# EAGLE board all_in_one_v2 (EAGLE 4.16), part 1 of 3
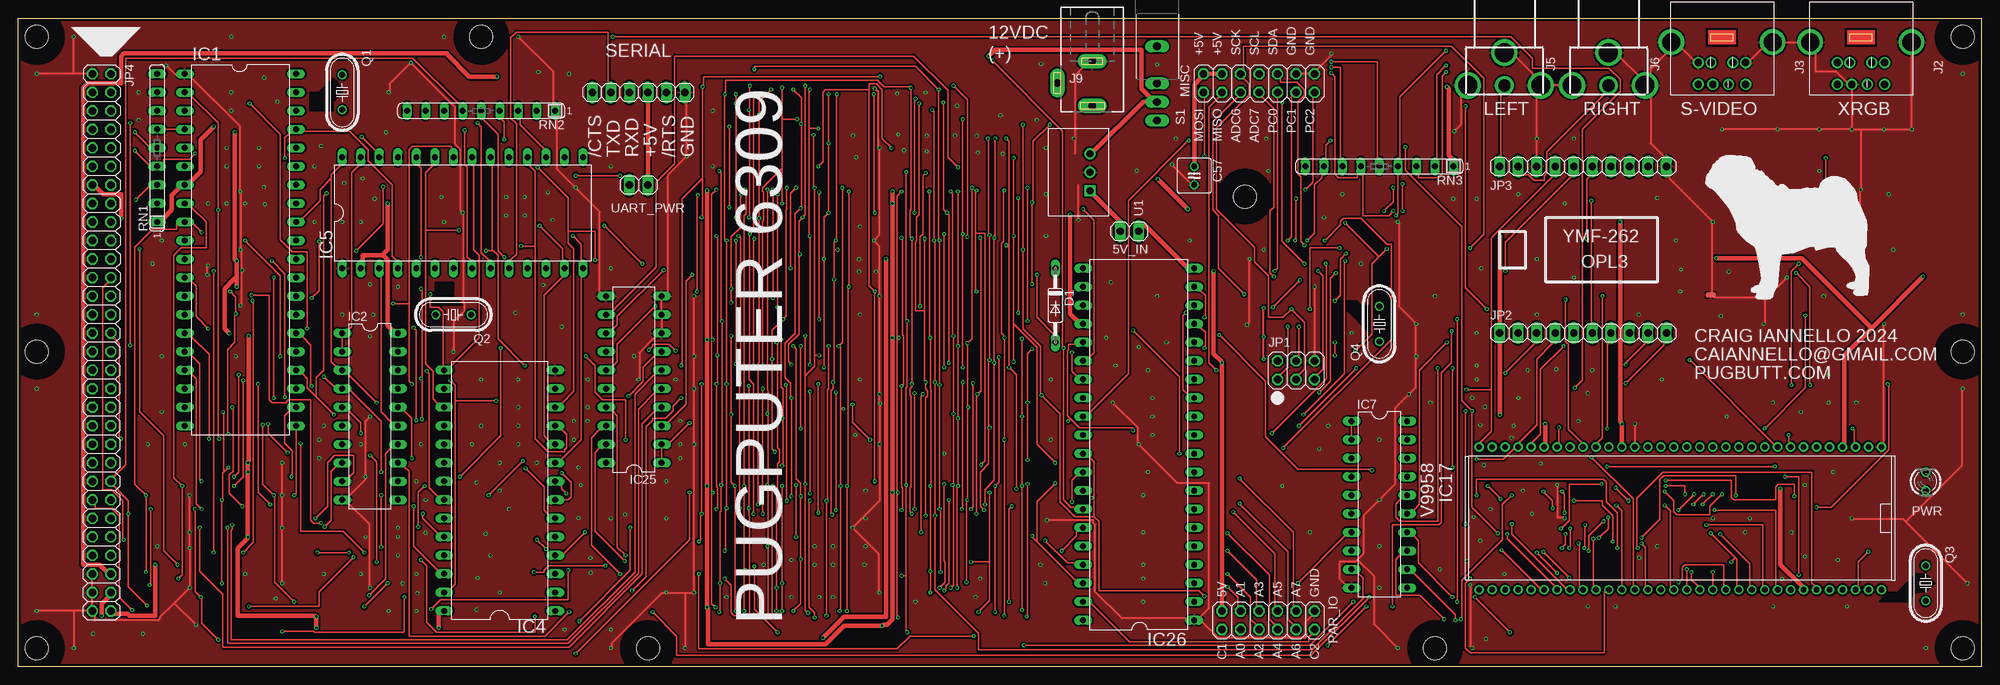
[diagram p2: board, top side]
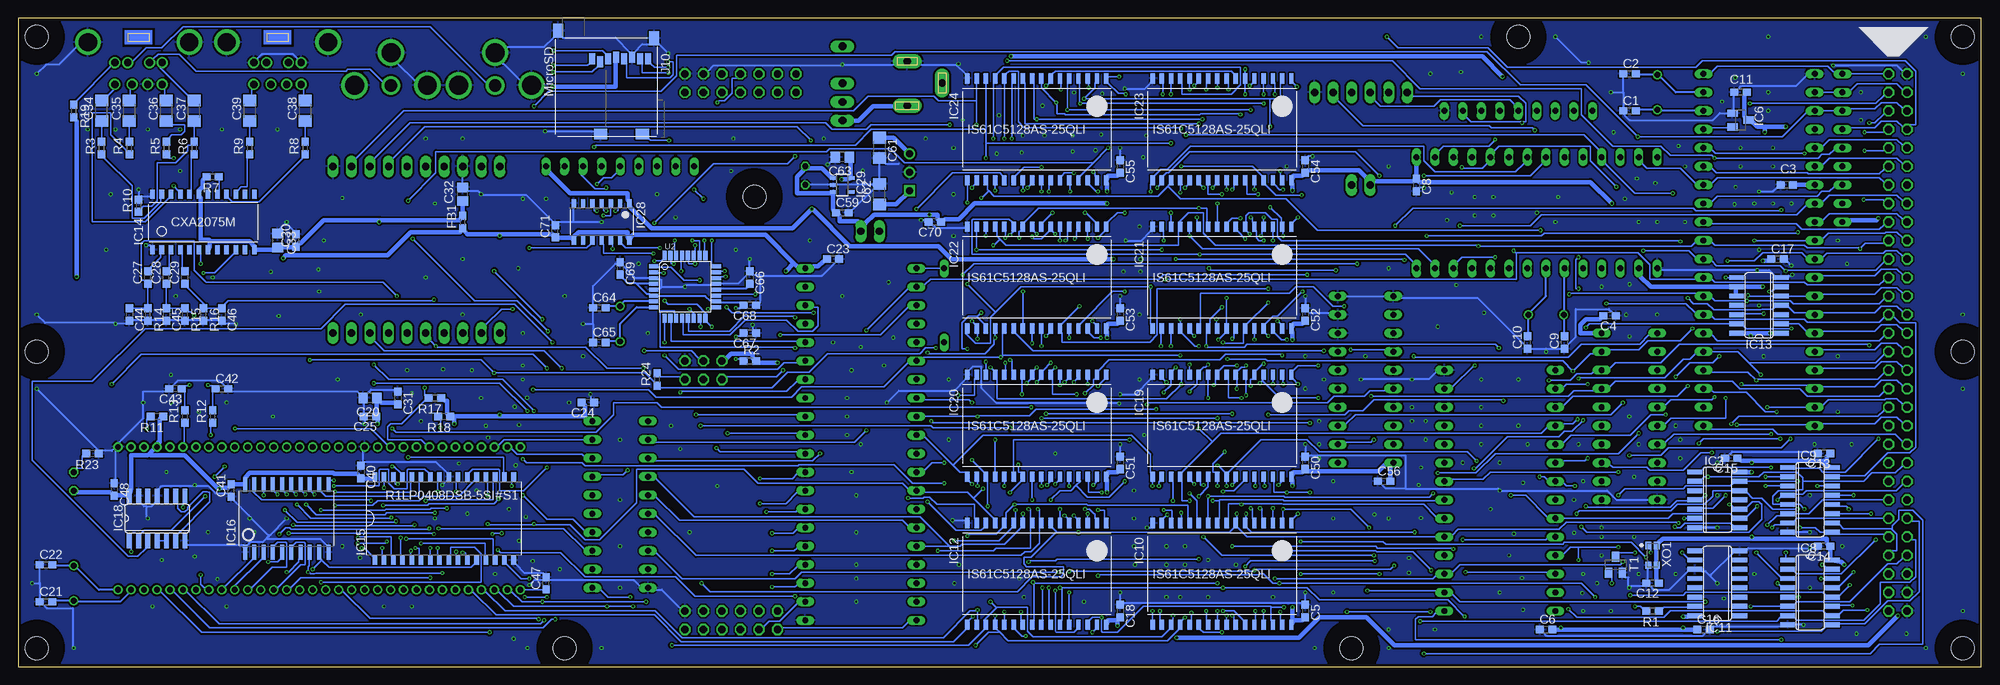
[diagram p3: board, bottom side, seen from below]

Size 269.24 x 88.9 mm. Coordinates in mm from the lower left corner, seen from the top.
Outline: 0,88.9 269.24,88.9 269.24,0 0,0 0,88.9
Copper layers (1*16): Top 0.0356mm / dielectric 1.6mm / Bottom 0.0356mm
Design rules "oshpark-2layer": minimum track width 6mil, minimum drill 10mil, track to track 6mil, track to pad 6mil, pad to pad 6mil, via to via 6mil, smd to smd 6mil, copper to edge 15mil, drill to drill 6mil, minimum pad ring 5mil, minimum via ring 5mil, stop-mask expansion 2.5mil, vias tented up to drill 0mil, thermal gap 10mil
Net classes: 0 default: width 0.203 mm, drill 0.203 mm, clearance 0.254 mm; 1 supply: width 0.61 mm, drill 0.203 mm, clearance 0.305 mm; 2 lowpwr: width 0.254 mm, drill 0.203 mm, clearance 0.254 mm
Holes 3.17 mm at 266.7,86.36 266.7,2.54 2.54,2.54 2.54,86.36 2.54,43.18 266.7,43.18 86.36,2.54 194.31,2.54 168.28,64.45 63.5,86.36
tRestrict: area -1.3,82.5 to 6.3,90.2; area -1.3,39.4 to 6.3,47; area -1.3,-1.3 to 6.3,6.3; area 82.5,-1.3 to 90.2,6.3; area 190.5,-1.3 to 198.1,6.3; area 262.9,-1.3 to 270.5,6.3; area 262.9,39.4 to 270.5,47; area 262.9,82.5 to 270.5,90.2; area 164.5,60.6 to 172.1,68.3; area 59.7,82.5 to 67.3,90.2; area 255.3,8.9 to 262.9,12.7; area 182.2,45.7 to 185.4,50.2; 2 more areas
bRestrict: area -1.3,82.5 to 6.4,90.2; area -1.3,39.3 to 6.4,47; area -1.3,-1.3 to 6.4,6.4; area 59.6,82.5 to 67.4,90.2; area 82.5,-1.3 to 90.2,6.4; area 164.4,60.6 to 172.1,68.3; area 262.8,39.3 to 270.6,47; area 262.8,82.5 to 270.6,90.2; area 190.4,-1.3 to 198.2,6.4; area 262.8,-1.3 to 270.6,6.4
vRestrict: area 180.3,72.4 to 195.6,88.9

## Footprints (pad centres in the part's own frame; a part is rotated, then mirrored left to right if it is on the bottom)
1X02 = drill 1.016 long: 1 -1.27,0; 2 1.27,0
C0603 = smd 1.1 x 1: 1 -0.85,0; 2 0.85,0
C0805 = smd 1.3 x 1.5: 1 -0.95,0; 2 0.95,0
C1206 = smd 1.6 x 1.8: 1 -1.4,0; 2 1.4,0
C025-050X050 = drill 0.813 octagon: 1 -1.27,0; 2 1.27,0
DO35-10 = drill 0.813 long: A 5.08,0; C -5.08,0
R0603 = smd 1.1 x 1: 1 -0.85,0; 2 0.85,0
DIL40 = drill 0.813 long: 1 -24.13,-7.62; 2 -21.59,-7.62; 3 -19.05,-7.62; 4 -16.51,-7.62; 5 -13.97,-7.62; 6 -11.43,-7.62; 7 -8.89,-7.62; 8 -6.35,-7.62; 9 -3.81,-7.62; 10 -1.27,-7.62; 11 1.27,-7.62; 12 3.81,-7.62; 13 6.35,-7.62; 14 8.89,-7.62; 15 11.43,-7.62; 16 13.97,-7.62; 17 16.51,-7.62; 18 19.05,-7.62; 19 21.59,-7.62; 20 24.13,-7.62; 21 24.13,7.62; 22 21.59,7.62; 23 19.05,7.62; 24 16.51,7.62; 25 13.97,7.62; 26 11.43,7.62; 27 8.89,7.62; 28 6.35,7.62; 29 3.81,7.62; 30 1.27,7.62; 31 -1.27,7.62; 32 -3.81,7.62; 33 -6.35,7.62; 34 -8.89,7.62; 35 -11.43,7.62; 36 -13.97,7.62; 37 -16.51,7.62; 38 -19.05,7.62; 39 -21.59,7.62; 40 -24.13,7.62
DIL20 = drill 0.813 long: 1 -11.43,-3.81; 2 -8.89,-3.81; 3 -6.35,-3.81; 4 -3.81,-3.81; 5 -1.27,-3.81; 6 1.27,-3.81; 7 3.81,-3.81; 8 6.35,-3.81; 9 8.89,-3.81; 10 11.43,-3.81; 11 11.43,3.81; 12 8.89,3.81; 13 6.35,3.81; 14 3.81,3.81; 15 1.27,3.81; 16 -1.27,3.81; 17 -3.81,3.81; 18 -6.35,3.81; 19 -8.89,3.81; 20 -11.43,3.81
SO14 = smd 0.66 x 2.032: 1 -3.81,-3.073; 2 -2.54,-3.073; 3 -1.27,-3.073; 4 0,-3.073; 5 1.27,-3.073; 6 2.54,-3.073; 7 3.81,-3.073; 8 3.81,3.073; 9 2.54,3.073; 10 1.27,3.073; 11 0,3.073; 12 -1.27,3.073; 13 -2.54,3.073; 14 -3.81,3.073
DIL28-6 = drill 0.813 long: 1 -16.51,-7.62; 2 -13.97,-7.62; 3 -11.43,-7.62; 4 -8.89,-7.62; 5 -6.35,-7.62; 6 -3.81,-7.62; 7 -1.27,-7.62; 8 1.27,-7.62; 9 3.81,-7.62; 10 6.35,-7.62; 11 8.89,-7.62; 12 11.43,-7.62; 13 13.97,-7.62; 14 16.51,-7.62; 15 16.51,7.62; 16 13.97,7.62; 17 11.43,7.62; 18 8.89,7.62; 19 6.35,7.62; 20 3.81,7.62; 21 1.27,7.62; 22 -1.27,7.62; 23 -3.81,7.62; 24 -6.35,7.62; 25 -8.89,7.62; 26 -11.43,7.62; 27 -13.97,7.62; 28 -16.51,7.62
SOT23 = smd 1 x 1.4: 1 -0.95,-1.1; 2 0.95,-1.1; 3 0,1.1
SO16 = smd 0.66 x 2.032: 1 -4.445,-3.073; 2 -3.175,-3.073; 3 -1.905,-3.073; 4 -0.635,-3.073; 5 0.635,-3.073; 6 1.905,-3.073; 7 3.175,-3.073; 8 4.445,-3.073; 9 4.445,3.073; 10 3.175,3.073; 11 1.905,3.073; 12 0.635,3.073; 13 -0.635,3.073; 14 -1.905,3.073; 15 -3.175,3.073; 16 -4.445,3.073
SOIC32_11.3MM_WID = smd 1.4 x 0.6: 1 -6.985,9.525; 2 -6.985,8.255; 3 -6.985,6.985; 4 -6.985,5.715; 5 -6.985,4.445; 6 -6.985,3.175; 7 -6.985,1.905; 8 -6.985,0.635; 9 -6.985,-0.635; 10 -6.985,-1.905; 11 -6.985,-3.175; 12 -6.985,-4.445; 13 -6.985,-5.715; 14 -6.985,-6.985; 15 -6.985,-8.255; 16 -6.985,-9.525; 17 6.985,-9.525; 18 6.985,-8.255; 19 6.985,-6.985; 20 6.985,-5.715; 21 6.985,-4.445; 22 6.985,-3.175; 23 6.985,-1.905; 24 6.985,-0.635; 25 6.985,0.635; 26 6.985,1.905; 27 6.985,3.175; 28 6.985,4.445; 29 6.985,5.715; 30 6.985,6.985; 31 6.985,8.255; 32 6.985,9.525
CXA2075M = smd 1.27 x 0.635: 1 -3.81,6.985; 2 -3.81,5.715; 3 -3.81,4.445; 4 -3.81,3.175; 5 -3.81,1.905; 6 -3.81,0.635; 7 -3.81,-0.635; 8 -3.81,-1.905; 9 -3.81,-3.175; 10 -3.81,-4.445; 11 -3.81,-5.715; 12 -3.81,-6.985; 13 3.81,-6.985; 14 3.81,-5.715; 15 3.81,-4.445; 16 3.81,-3.175; 17 3.81,-1.905; 18 3.81,-0.635; 19 3.81,0.635; 20 3.81,1.905; 21 3.81,3.175; 22 3.81,4.445; 23 3.81,5.715; 24 3.81,6.985
RENESAS_32-TSOP-II = smd 1.27 x 0.635: 1 -5.715,9.525; 2 -5.715,8.255; 3 -5.715,6.985; 4 -5.715,5.715; 5 -5.715,4.445; 6 -5.715,3.175; 7 -5.715,1.905; 8 -5.715,0.635; 9 -5.715,-0.635; 10 -5.715,-1.905; 11 -5.715,-3.175; 12 -5.715,-4.445; 13 -5.715,-5.715; 14 -5.715,-6.985; 15 -5.715,-8.255; 16 -5.715,-9.525; 17 5.715,-9.525; 18 5.715,-8.255; 19 5.715,-6.985; 20 5.715,-5.715; 21 5.715,-4.445; 22 5.715,-3.175; 23 5.715,-1.905; 24 5.715,-0.635; 25 5.715,0.635; 26 5.715,1.905; 27 5.715,3.175; 28 5.715,4.445; 29 5.715,5.715; 30 5.715,6.985; 31 5.715,8.255; 32 5.715,9.525
SOIC20 = smd 2 x 0.55: 1 -4.645,5.715; 2 -4.645,4.445; 3 -4.645,3.175; 4 -4.645,1.905; 5 -4.645,0.635; 6 -4.645,-0.635; 7 -4.645,-1.905; 8 -4.645,-3.175; 9 -4.645,-4.445; 10 -4.645,-5.715; 11 4.645,-5.715; 12 4.645,-4.445; 13 4.645,-3.175; 14 4.645,-1.905; 15 4.645,-0.635; 16 4.645,0.635; 17 4.645,1.905; 18 4.645,3.175; 19 4.645,4.445; 20 4.645,5.715
V9958 = drill 0.8 pad 1.27 round: 1 -27.59,-9.79; 2 -25.81,-9.79; 3 -24.03,-9.79; 4 -22.25,-9.79; 5 -20.47,-9.79; 6 -18.69,-9.79; 7 -16.91,-9.79; 8 -15.13,-9.79; 9 -13.35,-9.79; 10 -11.57,-9.79; 11 -9.79,-9.79; 12 -8.01,-9.79; 13 -6.23,-9.79; 14 -4.45,-9.79; 15 -2.67,-9.79; 16 -0.89,-9.79; 17 0.89,-9.79; 18 2.67,-9.79; 19 4.45,-9.79; 20 6.23,-9.79; 21 8.01,-9.79; 22 9.79,-9.79; 23 11.57,-9.79; 24 13.35,-9.79; 25 15.13,-9.79; 26 16.91,-9.79; 27 18.69,-9.79; 28 20.47,-9.79; 29 22.25,-9.79; 30 24.03,-9.79; 31 25.81,-9.79; 32 27.59,-9.79; 33 27.59,9.79; 34 25.81,9.79; 35 24.03,9.79; 36 22.25,9.79; 37 20.47,9.79; 38 18.69,9.79; 39 16.91,9.79; 40 15.13,9.79; 41 13.35,9.79; 42 11.57,9.79; 43 9.79,9.79; 44 8.01,9.79; 45 6.23,9.79; 46 4.45,9.79; 47 2.67,9.79; 48 0.89,9.79; 49 -0.89,9.79; 50 -2.67,9.79; 51 -4.45,9.79; 52 -6.23,9.79; 53 -8.01,9.79; 54 -9.79,9.79; 55 -11.57,9.79; 56 -13.35,9.79; 57 -15.13,9.79; 58 -16.91,9.79; 59 -18.69,9.79; 60 -20.47,9.79; 61 -22.25,9.79; 62 -24.03,9.79; 63 -25.81,9.79; 64 -27.59,9.79
SOIC14 = smd 1.2 x 0.6: 1 -2.54,3.81; 2 -2.54,2.54; 3 -2.54,1.27; 4 -2.54,0; 5 -2.54,-1.27; 6 -2.54,-2.54; 7 -2.54,-3.81; 8 2.54,-3.81; 9 2.54,-2.54; 10 2.54,-1.27; 11 2.54,0; 12 2.54,1.27; 13 2.54,2.54; 14 2.54,3.81
SOT23-5 = smd 0.5 x 1: 1 -0.95,-1.2; 2 0,-1.2; 3 0.95,-1.2; 4 0.95,1.2; 5 -0.95,1.2
MINI_DIN8 = drill 1 round: 1 1.5,8.3; 2 -1.5,8.3; 3 3.25,8.3; 4 1.25,11.3; 5 -3.25,8.3; 6 3.25,11.3; 7 -0.9,11.3; 8 -3.25,11.3 | drill 2.5 round: SG0 -6.95,5.5; SG1 6.95,5.5
RCA_JACK_CUI_RCJ-014_CP-1403-ND = drill 2.6 round: G0 -5,0; G1 0,4.5; G2 5,0 | drill 1.7 round: V 0,0
DCJ0202 = drill 1 pad 2 long: 1 0,3.1; 2 4.8,0; 3 0,-3
MICROSD_AMPHENOL_GTFP08432B1HR = smd 0.8 x 1.5: 1/DAT2 1.95,-10.3; 2/CD/DAT3 0.85,-9.9; 3/CMD -0.25,-10.3; 4/VDD -1.35,-10.5; 5/CLK -2.45,-10.3; 6/VSS -3.55,-10.5; 7/DAT0 -4.65,-10.3; 8/DAT1 -5.75,-10.3 | smd 1.8 x 1.4: CDET -4.95,0; GND0 0.75,0 | smd 1.4 x 1.9: GND1 -6.55,-13.15; GND2 6.6,-14.15
2X03 = drill 1.016 octagon: 1 -2.54,-1.27; 2 -2.54,1.27; 3 0,-1.27; 4 0,1.27; 5 2.54,-1.27; 6 2.54,1.27
1X10 = drill 1.016 long: 1 -11.43,0; 2 -8.89,0; 3 -6.35,0; 4 -3.81,0; 5 -1.27,0; 6 1.27,0; 7 3.81,0; 8 6.35,0; 9 8.89,0; 10 11.43,0
2X30 = drill 1.016 octagon: 1 -38.1,-1.27; 2 -38.1,1.27; 3 -35.56,-1.27; 4 -35.56,1.27; 5 -33.02,-1.27; 6 -33.02,1.27; 7 -30.48,-1.27; 8 -30.48,1.27; 9 -27.94,-1.27; 10 -27.94,1.27; 11 -25.4,-1.27; 12 -25.4,1.27; 13 -22.86,-1.27; 14 -22.86,1.27; 15 -20.32,-1.27; 16 -20.32,1.27; 17 -17.78,-1.27; 18 -17.78,1.27; 19 -15.24,-1.27; 20 -15.24,1.27; 21 -12.7,-1.27; 22 -12.7,1.27; 23 -10.16,-1.27; 24 -10.16,1.27; 25 -7.62,-1.27; 26 -7.62,1.27; 27 -5.08,-1.27; 28 -5.08,1.27; 29 -2.54,-1.27; 30 -2.54,1.27; 31 0,-1.27; 32 0,1.27; 33 2.54,-1.27; 34 2.54,1.27; 35 5.08,-1.27; 36 5.08,1.27; 37 7.62,-1.27; 38 7.62,1.27; 39 10.16,-1.27; 40 10.16,1.27; 41 12.7,-1.27; 42 12.7,1.27; 43 15.24,-1.27; 44 15.24,1.27; 45 17.78,-1.27; 46 17.78,1.27; 47 20.32,-1.27; 48 20.32,1.27; 49 22.86,-1.27; 50 22.86,1.27; 51 25.4,-1.27; 52 25.4,1.27; 53 27.94,-1.27; 54 27.94,1.27; 55 30.48,-1.27; 56 30.48,1.27; 57 33.02,-1.27; 58 33.02,1.27; 59 35.56,-1.27; 60 35.56,1.27
2X07 = drill 1.016 octagon: 1 -7.62,-1.27; 2 -7.62,1.27; 3 -5.08,-1.27; 4 -5.08,1.27; 5 -2.54,-1.27; 6 -2.54,1.27; 7 0,-1.27; 8 0,1.27; 9 2.54,-1.27; 10 2.54,1.27; 11 5.08,-1.27; 12 5.08,1.27; 13 7.62,-1.27; 14 7.62,1.27
2X06 = drill 1.016 octagon: 1 -6.35,-1.27; 2 -6.35,1.27; 3 -3.81,-1.27; 4 -3.81,1.27; 5 -1.27,-1.27; 6 -1.27,1.27; 7 1.27,-1.27; 8 1.27,1.27; 9 3.81,-1.27; 10 3.81,1.27; 11 6.35,-1.27; 12 6.35,1.27
LED3MM = drill 0.813 octagon: A -1.27,0; K 1.27,0
HC49/S = drill 0.813 round: 1 -2.413,0; 2 2.413,0
SIL9 = drill 0.813 long: 1 -10.16,0; 2 -7.62,0; 3 -5.08,0; 4 -2.54,0; 5 0,0; 6 2.54,0; 7 5.08,0; 8 7.62,0; 9 10.16,0
ROCKER_SPDT_EG4328-ND = drill 1.09 long: 1 0,-5.135; 2 0,-7.675; 3 0,-10.215; ANCH 0,-0.055
1X06 = drill 1.016 long: 1 -6.35,0; 2 -3.81,0; 3 -1.27,0; 4 1.27,0; 5 3.81,0; 6 6.35,0
SOT23-BEC = smd 1 x 1.4: B -0.95,-1.1; C 0,1.1; E 0.95,-1.1
VREG_5V_CP_POWER_VR10S05 = drill 1 round: GND 0,0; VOUT 2.54,0 | drill 1 square: VIN -2.54,0
TQFP32-08 = smd 1.27 x 0.559: 1 -4.293,2.8; 2 -4.293,2; 3 -4.293,1.2; 4 -4.293,0.4; 5 -4.293,-0.4; 6 -4.293,-1.2; 7 -4.293,-2; 8 -4.293,-2.8; 17 4.293,-2.8; 18 4.293,-2; 19 4.293,-1.2; 20 4.293,-0.4; 21 4.293,0.4; 22 4.293,1.2; 23 4.293,2; 24 4.293,2.8 | smd 0.559 x 1.27: 9 -2.8,-4.293; 10 -2,-4.293; 11 -1.2,-4.293; 12 -0.4,-4.293; 13 0.4,-4.293; 14 1.2,-4.293; 15 2,-4.293; 16 2.8,-4.293; 25 2.8,4.293; 26 2,4.293; 27 1.2,4.293; 28 0.4,4.293; 29 -0.4,4.293; 30 -1.2,4.293; 31 -2,4.293; 32 -2.8,4.293
LARGE_PUG = smd 1.27 x 0.635: P$1 2.286,3.962
32K_XO_OM-7604-C7 = smd 1 x 0.8: CKOUT -1.35,-0.6; GND 1.35,-0.6; OE 1.35,0.6; VDD -1.35,0.6

## Placement (x,y rotation side)
5V_IN  [1X02]  152.4,59.69 180 top
C1  22p  [C0603]  48.26,76.2 0 bottom
C2  22p  [C0603]  48.26,81.28 0 bottom
C3  0.1u  [C0603]  26.67,66.04 180 bottom
C4  0.1u  [C0603]  50.96,48.1 180 bottom
C5  0.1u  [C0603]  92.71,7.62 270 bottom
C6  0.1u  [C0603]  59.69,5.08 0 bottom
C8  0.1u  [C0603]  77.47,66.04 270 bottom
C9  22p  [C0603]  57.15,44.45 90 bottom
C10  22p  [C0603]  62.23,44.45 90 bottom
C11  0.1u  [C0603]  33.02,78.74 180 bottom
C12  0.1u  [C0603]  45.09,11.43 180 bottom
C13  0.1u  [C0603]  21.59,29.21 180 bottom
C14  0.1u  [C0603]  21.59,16.51 180 bottom
C15  0.1u  [C0603]  34.29,28.57 180 bottom
C16  0.1u  [C0603]  38.1,5.08 0 bottom
C17  0.1u  [C0603]  27.94,55.88 0 bottom
C18  0.1u  [C0603]  118.11,7.62 270 bottom
C20  47u  [C0805]  220.98,36.83 180 bottom
C21  22p  [C0603]  265.43,8.89 0 bottom
C22  22p  [C0603]  265.43,13.97 0 bottom
C23  0.1u  [C0603]  157.48,55.88 0 bottom
C24  0.1u  [C0603]  191.13,36.2 180 bottom
C25  0.1u  [C0603]  220.98,34.29 180 bottom
C27  0.1u  [C0603]  251.46,53.34 90 bottom
C28  0.1u  [C0603]  248.92,53.34 90 bottom
C29  0.1u  [C0603]  246.38,53.34 90 bottom
C30  0.01u  [C0603]  231.14,58.42 90 bottom
C31  0.01u  [C0603]  217.17,36.83 270 bottom
C32  47u  [C0805]  208.28,64.77 90 bottom
C33  47u  [C0805]  233.68,58.42 270 bottom
C34  220u  [C1206]  257.81,76.2 90 bottom
C35  220u  [C1206]  254,76.2 90 bottom
C36  220u  [C1206]  248.92,76.2 90 bottom
C37  220u  [C1206]  245.11,76.2 90 bottom
C38  220u  [C1206]  229.87,76.2 90 bottom
C39  220u  [C1206]  237.49,76.2 90 bottom
C40  0.1u  [C0603]  222.25,26.67 270 bottom
C41  0.1u  [C0603]  240.03,24.13 90 bottom
C42  5p  [C0603]  241.3,38.1 0 bottom
C43  47p  [C0603]  247.65,38.1 180 bottom
C44  330p  [C0603]  254,48.26 270 bottom
C45  330p  [C0603]  248.92,48.26 270 bottom
C46  330p  [C0603]  241.3,48.26 270 bottom
C47  0.1u  [C0603]  196.85,11.43 90 bottom
C48  0.1u  [C0603]  256.06,24.29 270 bottom
C50  0.1u  [C0603]  92.71,27.94 270 bottom
C51  0.1u  [C0603]  118.11,27.94 270 bottom
C52  0.1u  [C0603]  92.71,48.26 270 bottom
C53  0.1u  [C0603]  118.11,48.26 270 bottom
C54  0.1u  [C0603]  92.71,68.58 270 bottom
C55  0.1u  [C0603]  118.11,68.58 270 bottom
C56  0.1u  [C0603]  81.92,25.4 0 bottom
C57  220U  [C025-050X050]  161.29,67.31 270 top
C59  0.1u  [C0603]  156.21,62.23 0 bottom
C61  22u  [C1206]  151.13,71.12 270 bottom
C62  22u  [C1206]  151.13,64.77 90 bottom
C63  22u  [C0805]  156.21,69.85 180 bottom
C64  22p  [C0603]  189.55,49.21 0 bottom
C65  22p  [C0603]  189.55,44.45 0 bottom
C66  0.1u  [C0603]  168.91,53.34 270 bottom
C67  0.1u  [C0603]  168.91,45.72 180 bottom
C68  0.1u  [C0603]  168.91,49.53 180 bottom
C69  0.1u  [C0603]  186.69,54.61 270 bottom
C70  0.1u  [C0603]  143.51,60.96 180 bottom
C71  0.1u  [C0603]  195.58,59.69 90 bottom
D1  1N4148  [DO35-10]  142.24,49.53 270 top
FB1  [R0603]  208.28,60.96 90 bottom
IC1  HD63C09P  [DIL40]  30.48,57.15 270 top
IC2  PLD_ATF16V8B  [DIL20]  48.26,34.29 270 top
IC3  74ALS21D  [SO14]  36.2,22.86 270 bottom
IC4  EEP_32KX8_AT28C256  [DIL28-6]  66.04,24.13 90 top
IC5  UART_W65C51N  [DIL28-6]  60.96,62.23 0 top
IC6  POR_APX803L05-33SA-7  [SOT23]  33.02,74.93 270 bottom
IC7  PLD_ATF16V8B  [DIL20]  186.69,22.23 270 top
IC8  74LS670D  [SO16]  23.5,10.16 270 bottom
IC9  74LS670D  [SO16]  23.5,22.86 270 bottom
IC10  IS61C5128AS  [SOIC32_11.3MM_WID]  104.14,12.7 270 bottom
IC11  74HC4040D  [SO16]  36.2,11.43 90 bottom
IC12  IS61C5128AS  [SOIC32_11.3MM_WID]  129.54,12.7 270 bottom
IC13  74ALS21D  [SO14]  30.48,49.53 90 bottom
IC14  CXA2075M  [CXA2075M]  243.84,60.96 90 bottom
IC15  R1LP0408DSB-5SI#S1  [RENESAS_32-TSOP-II]  210.82,20.32 90 bottom
IC16  SN74AHC574PWRSO  [SOIC20]  232.41,20.32 90 bottom
IC17  YAMAHA_V9958  [V9958]  227.97,20.32 180 top
IC18  74ALS04D  [SO14]  250.19,20.32 0 bottom
IC19  IS61C5128AS  [SOIC32_11.3MM_WID]  104.14,33.02 270 bottom
IC20  IS61C5128AS  [SOIC32_11.3MM_WID]  129.54,33.02 270 bottom
IC21  IS61C5128AS  [SOIC32_11.3MM_WID]  104.14,53.34 270 bottom
IC22  IS61C5128AS  [SOIC32_11.3MM_WID]  129.54,53.34 270 bottom
IC23  IS61C5128AS  [SOIC32_11.3MM_WID]  104.14,73.66 270 bottom
IC24  IS61C5128AS  [SOIC32_11.3MM_WID]  129.54,73.66 270 bottom
IC25  PLD_ATF16V8B  [DIL20]  84.45,39.37 90 top
IC26  W65C22S6TBG-14  [DIL40]  153.67,30.48 90 top
IC28  TXB0104D  [SOIC14]  189.23,60.96 270 bottom
IC29  MIC5317_3.3V  [SOT23-5]  156.21,66.04 270 bottom
J2  XRGB  [MINI_DIN8]  252.73,91.12 180 top
J3  S-VIDEO  [MINI_DIN8]  233.68,91.12 180 top
J5  [RCA_JACK_CUI_RCJ-014_CP-1403-ND]  203.84,79.69 0 top
J6  [RCA_JACK_CUI_RCJ-014_CP-1403-ND]  218.12,79.69 0 top
J9  DCJ0202  [DCJ0202]  147.32,80.01 180 top
J10  MICROSD_AMPHENOL_GTFP084328  [MICROSD_AMPHENOL_GTFP08432B1HR]  188.59,73.03 180 bottom
JP1  [2X03]  175.26,40.64 0 top
JP2  [1X10]  214.63,45.72 0 top
JP3  [1X10]  214.63,68.58 0 top
JP4  [2X30]  11.43,43.18 270 top
MISC  [2X07]  170.18,80.01 0 top
PAR_IO  [2X06]  171.45,6.35 0 top
PWR  [LED3MM]  261.62,25.4 90 top
Q1  14.31818M  [HC49/S]  44.45,78.74 270 top
Q2  1.8432M  [HC49/S]  59.69,48.26 180 top
Q3  21.47727M  [HC49/S]  261.62,11.43 270 top
Q4  20M  [HC49/S]  186.69,46.99 90 top
R1  1k  [R0603]  45.09,7.62 180 bottom
R2  0R  [R0603]  168.91,41.91 0 bottom
R3  75R  [R0603]  257.81,71.12 90 bottom
R4  75R  [R0603]  254,71.12 90 bottom
R5  75R  [R0603]  248.92,71.12 90 bottom
R6  43R  [R0603]  245.11,71.12 90 bottom
R7  3.32K 1%  [R0603]  242.57,67.15 180 bottom
R8  75R  [R0603]  229.87,71.12 90 bottom
R9  75R  [R0603]  237.49,71.12 90 bottom
R10  240R  [R0603]  252.73,63.18 90 bottom
R11  4.7k  [R0603]  250.19,34.29 180 bottom
R12  2k2  [R0603]  242.57,34.29 90 bottom
R13  2k2  [R0603]  246.38,34.29 90 bottom
R14  470R  [R0603]  251.46,48.26 270 bottom
R15  470R  [R0603]  246.38,48.26 270 bottom
R16  470R  [R0603]  243.84,48.26 270 bottom
R17  4.7k  [R0603]  212.09,36.83 180 bottom
R18  4.7k  [R0603]  210.82,34.29 180 bottom
R19  75R  [R0603]  261.62,76.2 270 bottom
R23  680R  [R0603]  259.08,29.21 180 bottom
R24  1k  [R0603]  181.61,39.37 90 bottom
RN1  10K  [SIL9]  19.05,71.12 90 top
RN2  10K  [SIL9]  63.5,76.2 180 top
RN3  10K  [SIL9]  186.69,68.58 180 top
S1  ROCKEREG4328-ND  [ROCKER_SPDT_EG4328-ND]  156.21,85.09 0 top
SERIAL  [1X06]  85.09,78.74 180 top
T1  MMBT2222A  [SOT23-BEC]  50.16,13.97 0 bottom
U1  VREG_5V_VR10S05  [VREG_5V_CP_POWER_VR10S05]  147,67.78 90 top
U2  ATMEGA238PTQFP_  [TQFP32-08]  177.8,52.07 0 bottom
U$2  PUG  [LARGE_PUG]  229.87,46.99 0 top
UART_PWR  [1X02]  85.09,66.04 0 top
XO1  XODC_32KHZ_OM-7604-C7  [32K_XO_OM-7604-C7]  45.09,15.24 270 bottom

## Tracks (layer width: path | path; a pad name or v marks a point on that pad's centre or on a via)
+3V3  (via drill 0.3)
  Top 0.61: v195.96,79.5 196.22,79.25 196.22,70.1 196.6,69.72 RN3.1 | v160.4,62.74 v156.34,66.8 | v11.43,6.99 11.43,8.64 12.32,9.53 JP4.58 | v110.36,3.94 113.28,6.86 119,6.86 v119,55.88
  Bottom 0.61: C63.1 155.07,69.22 155.07,67.18 IC29.5 155.45,66.8 v156.34,66.8 | RN3.1 196.34,67.69 193.55,64.9 185.67,64.9 185.67,64.01 IC28.1 185.29,62.99 182.37,60.07 163.07,60.07 v160.4,62.74 160.15,62.61 155.19,57.66 143,57.66 141.22,55.88 v119,55.88 | v195.96,79.5 187.32,79.5 187.32,82.8 J10.4/VDD | v11.43,6.99 15.49,2.92 80.52,2.92 84.33,6.73 90.81,6.73 93.6,3.94 v110.36,3.94
+12V  (via drill 0.3)
  Top 0.61: v65.66,80.9 61.85,80.9 58.8,83.95 58.8,84.07 14.48,84.07 14.1,83.69 14.1,80.01 9.53,80.01 8.89,79.38 8.89,13.97 11.18,13.97 12.06,13.08 JP4.56 | v133.1,83.69 133.99,84.58 154.05,84.58 154.05,79.25 156.13,77.17 156.35,77.17 156.35,77.27 S1.2 156.21,77.47 154.31,77.47 147.16,70.32 U1.VOUT
  Bottom 0.61: v65.66,80.9 68.45,83.69 v133.1,83.69 | U1.VOUT 147.01,70.32 147.02,70.32 149.22,72.52 C61.1
/BREQ  (via drill 0.25)
  Top 0.203: v16.13,64.01 17.91,65.79 RN1.3
  Bottom 0.203: RN1.3 20.19,65.79 20.83,65.15 21.84,65.15 22.48,64.52 36.2,64.52 36.96,63.75 IC1.33 | v16.13,64.01 13.46,64.01 13.34,63.88 JP4.16
/CAS0  (via drill 0.25)
  Top 0.203: v219.33,16.26 219.33,21.08 217.81,22.61 217.81,25.27 217.42,25.65 200.03,25.65 v200.03,23.5 | v204.6,4.7 v199.77,9.53 | v196.72,9.53 192.02,14.22 192.02,17.27 191.39,17.91 IC7.14
  Bottom 0.203: v219.33,16.26 219.33,15.11 IC15.2 | v200.03,23.5 196.72,20.19 193.17,20.19 191.64,18.67 IC7.14 | v204.6,4.7 244.09,4.7 249.68,10.29 IC17.61 | v199.77,9.53 v196.72,9.53
/CAS1  (via drill 0.25)
  Top 0.203: v217.17,25.02 212.72,25.02 212.72,20.07 v211.58,18.92 | v195.58,6.48 192.28,9.78 188.98,9.78 188.98,14.73 189.61,15.37 IC7.13
  Bottom 0.203: v217.17,25.02 217.55,25.02 217.55,25.53 IC15.30 | v211.58,18.92 194.44,18.92 191.64,16.13 IC7.13 | v195.58,6.48 196.09,6.48 197.23,5.33 242.95,5.33 247.9,10.29 IC17.60
/CASX  (via drill 0.25)
  Top 0.203: v222.12,16.26 222,16.38 222,23.11 225.55,26.67 246,26.67 246,11.43 246.38,11.05 IC17.59 | v197.1,6.35 197.1,7.11 191.39,12.83 IC7.12
  Bottom 0.203: v222.12,16.26 221.74,16.26 220.6,15.11 IC15.1 | v197.1,6.35 197.61,5.84 241.68,5.84 246.13,10.29 IC17.59
/CSR
  Bottom 0.203: IC7.18 191.64,28.83 191.9,29.08 200.79,29.08 201.55,29.84 IC17.31
/CSW
  Bottom 0.203: IC7.19 202.56,31.11 203.33,30.35 IC17.30
/CSYNC
  Bottom 0.203: R13.1 246.51,32.89 246.51,30.73 IC17.6
/DLCLK  (via drill 0.25)
  Top 0.203: v251.59,32.64 251.84,32.38 251.84,30.73 IC17.3
  Bottom 0.203: v251.59,32.64 251.59,33.91 R11.2
/FIRQ  (via drill 0.25)
  Top 0.203: RN1.6 IC1.4 | v213.49,38.23 214.5,39.24 214.5,73.66 219.71,78.87 219.71,80.52 218.19,82.04 207.65,82.04 207.65,83.44 204.72,86.36 v81.53,86.36
  Bottom 0.203: IC17.25 213.36,30.48 214,31.11 218.57,31.11 218.57,32.89 218.19,33.27 216.66,33.27 213.49,36.45 R17.2 213.49,37.21 v213.49,38.23 | RN1.6 17.91,73.91 14.61,73.91 13.72,74.8 11.56,74.8 10.79,74.04 JP4.7 9.78,74.3 9.02,74.3 9.02,81.66 10.41,83.06 38.23,83.06 39.12,82.17 65.02,82.17 67.69,84.84 80.01,84.84 v81.53,86.36
/HALT
  Bottom 0.203: JP4.2 RN1.9 20.19,81.53 20.32,81.53 21.08,82.3 36.2,82.3 36.96,81.53 IC1.40
/IO  (via drill 0.25)
  Top 0.203: v36.96,29.34 34.29,32 v34.29,33.27 | v185.29,9.53 177.29,1.52 90.3,1.52 90.3,4.19 v87,7.49 | v75.56,7.49 72.26,4.19 53.59,4.19 53.59,26.8 52.96,27.43 IC2.13
  Bottom 0.203: v36.96,29.34 38.48,29.34 40.89,26.92 45.47,26.92 45.85,27.3 50.55,27.3 50.93,27.69 IC2.13 | v34.29,33.27 33.27,34.29 14.22,34.29 13.34,35.18 JP4.38 | v185.29,9.53 188.34,9.53 189.36,10.54 IC7.11 | v75.56,7.49 v87,7.49
/IRQ  (via drill 0.25)
  Top 0.203: v47.12,72.64 49.02,70.74 IC5.26 | v201.42,49.02 198.5,51.94 v198.5,76.83
  Bottom 0.203: v201.42,49.02 202.95,49.02 205.1,46.86 JP2.2 | v198.5,76.83 196.47,78.87 181.1,78.87 178.94,81.03 178.94,83.82 149.48,83.82 148.97,84.33 67.82,84.33 63.25,79.76 54.23,79.76 v47.12,72.64 27.3,72.64 24,75.95 IC1.3 RN1.7 17.91,76.45 14.61,76.45 13.72,77.34 11.56,77.34 10.79,76.58 JP4.5
/MR  (via drill 0.25)
  Top 0.203: v17.65,8.38 15.11,10.92 v15.11,20.95 15.11,22.73 13.08,24.77 JP4.46 13.08,26.04 14.73,27.69 14.73,83.44 54.1,83.44 60.45,77.09 RN2.6
  Bottom 0.203: v17.65,8.38 19.43,8.38 IC8.11 | v15.11,20.95 IC9.11
/MRDY  (via drill 0.25)
  Top 0.203: v16,70.74 17.91,68.83 RN1.4 19.94,69.09 19.94,69.6 23.5,69.6 v24.26,70.36
  Bottom 0.203: v16,70.74 13.34,70.74 JP4.10 | v24.26,70.36 36.45,70.36 36.96,70.87 IC1.36
/MW  (via drill 0.25)
  Top 0.203: v18.03,11.18 18.16,11.3 v18.16,21.59 | v48.13,9.78 50.42,12.06 50.42,29.21 51.18,29.97 IC2.14
  Bottom 0.203: v18.03,11.18 19.43,9.78 IC8.12 21.34,9.78 21.72,10.16 40.51,10.16 40.89,9.78 v48.13,9.78 | v18.16,21.59 18.54,21.97 19.43,21.97 IC9.12
/NMI  (via drill 0.25)
  Top 0.203: v47.5,15.62 44.58,18.54 38.73,18.54 v38.73,30.61 | v27.56,31.24 27.43,31.37 v27.43,62.61 27.43,74.55 23.75,78.23 IC1.2 | v139.7,53.72 139.7,47.88 141.99,45.59 D1.A | v80.39,60.45 v85.6,55.24
  Bottom 0.203: v47.5,15.62 49.78,15.62 T1.C | v38.73,30.61 38.1,31.24 v27.56,31.24 | IC1.2 RN1.8 17.91,78.99 17.02,79.88 11.56,79.88 10.79,79.12 JP4.3 | v139.7,53.72 138.18,55.24 v85.6,55.24 | v80.39,60.45 77.98,62.87 39.5,62.87 39.12,62.48 27.56,62.48 v27.43,62.61
/OPL  (via drill 0.25)
  Top 0.203: v194.69,40.89 194.69,19.94 189.48,19.94 188.98,20.45 188.98,22.35 189.61,22.99 IC7.16
  Bottom 0.203: v194.69,40.89 197.1,43.31 219.07,43.31 220.34,44.58 JP2.8
/R  (via drill 0.25)
  Top 0.203: v178.31,54.23 178.94,53.59 178.94,40.77 178.18,40.01 JP1.5
  Bottom 0.203: R24.2 181.23,39.75 178.44,39.75 JP1.5 | v178.31,54.23 178.31,55.75 U2.29
/RAM  (via drill 0.25)
  Top 0.203: v83.69,37.08 85.72,39.12 85.72,41.02 87.38,42.67 IC25.7
  Bottom 0.203: JP4.36 13.34,37.72 13.97,37.08 23.88,37.08 24.89,38.1 33.15,38.1 34.16,39.12 50.16,39.12 50.93,38.35 IC2.17 53.21,37.85 55.88,37.85 56.64,37.08 v83.69,37.08
/RAM0  (via drill 0.25)
  Top 0.203: v104.14,4.7 100.97,7.87 v100.97,13.72 | v83.19,14.48 79.12,18.54 79.12,29.34 79.76,29.97 IC25.19
  Bottom 0.203: v104.14,4.7 106.68,4.7 107.06,5.08 IC10.22 | v100.97,13.72 100.2,14.48 v83.19,14.48
/RAM1  (via drill 0.25)
  Top 0.203: v131.06,4.19 122.3,4.19 120.52,2.41 93.34,2.41 v93.34,12.7 | v82.55,12.7 78.61,16.64 78.61,31.37 79.76,32.51 IC25.18
  Bottom 0.203: v131.06,4.19 131.57,4.19 132.46,5.08 IC12.22 | v82.55,12.7 v93.34,12.7
/RAM2  (via drill 0.25)
  Top 0.203: v106.68,17.78 v106.68,24.89 | v83.31,15.24 82.17,16.38 82.17,34.42 81.53,35.05 IC25.17
  Bottom 0.203: v106.68,24.89 107.06,24.89 107.06,25.4 IC19.22 | v106.68,17.78 104.14,15.24 v83.31,15.24
/RAM3  (via drill 0.25)
  Top 0.203: v116.84,31.11 114.43,33.53 v114.43,35.94
  Bottom 0.203: v116.84,31.11 132.72,31.11 IC20.22 | v114.43,35.94 114.17,36.2 89.66,36.2 88.77,37.08 84.58,37.08 83.82,37.85 81.79,37.85 IC25.16
/RAM4  (via drill 0.25)
  Top 0.203: v87.38,49.4 82.17,44.2 82.17,41.78 81.53,41.15 IC25.15
  Bottom 0.203: v87.38,49.4 88.9,49.4 91.57,52.07 93.98,52.07 94.87,51.18 107.06,51.18 107.06,46.99 IC21.22
/RAM5  (via drill 0.25)
  Top 0.203: v90.17,43.31 89.28,44.2 87,44.2 87,43.94 v86.49,43.43
  Bottom 0.203: v90.17,43.31 130.05,43.31 132.46,45.72 IC22.22 | v86.49,43.43 81.79,43.43 IC25.14
/RAM6  (via drill 0.25)
  Top 0.203: v106.68,65.66 105.92,64.9 v105.92,54.61 | v88.52,54.36 82.17,48.01 82.17,46.86 81.53,46.23 IC25.13
  Bottom 0.203: v106.68,65.66 107.06,66.04 IC23.22 | v105.92,54.61 105.66,54.36 v88.52,54.36
/RAM7  (via drill 0.25)
  Top 0.203: v128.91,68.45 127.51,69.85 127.51,78.99 122.81,83.69 90.04,83.69 90.04,68.96 87.5,66.42 87.5,54.74 81.53,48.77 IC25.12
  Bottom 0.203: v128.91,68.45 131.32,68.45 132.46,67.31 IC24.22
/RAS  (via drill 0.25)
  Top 0.203: v253.75,15.75 252.35,14.35 252.35,11.05 IC17.62
  Bottom 0.203: v253.75,15.75 253.75,16.26 IC18.1
/RD  (via drill 0.25)
  Top 0.203: v56.01,40.51 56.39,40.13 56.39,24.51 57.53,23.37 IC4.22 | v31.75,77.22 35.94,73.03 35.94,58.55 37.59,56.9 39.62,56.9 v39.62,46.35 | v105.41,65.66 105.41,62.74 105.28,62.61 105.28,48.01 v104.9,47.62 103.38,46.1 v103.38,42.16 103.38,29.84 v103.76,29.46 | v104.78,24.77 v104.78,11.43 v104.78,7.62 | v130.05,11.56 130.05,22.73 v130.18,22.86 130.18,35.56 | 130.18,35.56 v130.18,44.32 130.81,44.96 v130.81,65.66 | v217.93,32.64 217.93,44.2 218.06,44.32 JP2.7 | v130.3,35.56 130.18,35.56
  Bottom 0.203: v31.75,77.22 14.48,77.22 13.34,78.36 JP4.4 | v39.62,46.35 41.27,44.7 45.72,44.7 46.99,43.43 50.93,43.43 IC2.19 53.21,42.93 53.59,42.93 v56.01,40.51 57.4,41.91 97.92,41.91 98.17,42.16 v103.38,42.16 | v104.9,47.62 104.9,46.99 IC21.24 | v105.41,65.66 105.03,66.04 IC23.24 | v104.78,7.62 IC10.24 | v104.78,24.77 IC19.24 105.03,26.67 105.41,26.67 105.41,27.81 v103.76,29.46 | 129.92,11.43 129.92,6.35 IC12.24 | 129.92,11.43 v104.78,11.43 | v130.05,11.56 129.92,11.43 | v130.18,22.86 IC20.24 | v130.18,44.32 IC22.24 | v130.81,65.66 130.43,66.04 IC24.24 | v217.93,32.64 217.42,32.13 189.99,32.13 187.58,34.54 187.58,36.2 181.61,36.2 180.97,35.56 v130.3,35.56
/RES  (via drill 0.25)
  Top 0.203: v16,73.28 17.91,71.37 RN1.5 | IC5.4 51.82,55.75 51.31,56.26 51.31,66.04 48.01,69.34 48.01,70.87 45.47,73.41 39.24,73.41 IC1.37 37.21,73.15 36.58,72.52 v36.58,69.72 | v203.96,40.26 207.9,44.2 207.9,44.32 JP2.3 | IC26.34 144.91,21.84 144.27,21.84 144.27,21.97 143.38,22.86 v143.38,43.69 143.26,43.81 143.26,73.41 v133.6,83.06 | v229.24,42.04 240.79,30.48 IC17.9
  Bottom 0.203: v16,73.28 13.34,73.28 JP4.8 | IC6.2 34.8,73.91 36.96,73.91 IC1.37 | RN1.5 20.19,70.87 20.83,70.23 21.84,70.23 22.35,69.72 v36.58,69.72 36.96,70.1 42.67,70.1 43.94,71.37 50.55,71.37 54.86,75.69 54.86,79.25 76.96,79.25 80.77,83.06 v133.6,83.06 | v143.38,43.69 144.78,43.69 145.54,42.93 158.24,42.93 160.78,40.39 163.7,40.39 165.86,38.23 181.23,38.23 R24.1 181.99,38.99 183.26,40.26 v203.96,40.26 205.74,42.04 v229.24,42.04
/ROM  (via drill 0.25)
  Top 0.203: v53.98,28.57 53.98,34.04 52.96,35.05 IC2.16
  Bottom 0.203: v53.98,28.57 54.36,28.19 57.28,28.19 IC4.20
/SDSS  (via drill 0.25)
  Top 0.203: v187.32,62.48 188.59,63.75 v188.59,65.66 | v195.83,81.53 195.33,81.03 195.33,67.56 194.82,67.06 192.02,67.06 192.02,67.44 RN3.3
  Bottom 0.203: v187.32,62.48 186.94,62.48 186.94,62.99 IC28.2 | v188.59,65.66 188.72,65.53 190.12,65.53 192.02,67.44 RN3.3 | v195.83,81.53 190.5,81.53 189.74,82.3 J10.2/CD/DAT3
/SS  (via drill 0.25)
  Top 0.203: v181.23,57.4 177.16,57.4 v177.16,49.02
  Bottom 0.203: v181.23,57.4 185.93,57.4 186.44,57.91 IC28.13 | v177.16,49.02 176.53,48.39 U2.14
/UART
  Top 0.203: IC2.15 51.18,33.53 49.78,34.92 49.78,53.47 IC5.3
/VCS  (via drill 0.25)
  Top 0.203: v196.72,40.89 v196.72,27.3 | v256.41,38.73 256.54,38.61 256.54,29.72 248.67,21.84 v246.63,21.84
  Bottom 0.203: v196.72,27.3 199.9,24.13 203.2,24.13 203.2,26.92 203.33,27.05 206.88,27.05 207.39,26.54 IC15.22 | v196.72,40.89 198.63,42.8 252.35,42.8 v256.41,38.73 | v246.63,21.84 246.63,22.48 IC18.8
/VIA  (via drill 0.25)
  Top 0.203: v164.72,45.47 171.07,39.12 171.07,31.5 175.51,27.05 185.67,27.05 v185.67,26.92
  Bottom 0.203: v164.72,45.47 151,45.47 147.19,49.28 IC26.23 | v185.67,26.92 186.31,26.29 189.36,26.29 IC7.17
/VWR  (via drill 0.25)
  Top 0.203: v240.92,27.43 v217.93,27.43 | v242.32,26.04 244.22,26.04 v244.22,12.57
  Bottom 0.203: v217.93,27.43 217.68,27.43 216.79,26.54 IC15.29 | v242.32,26.04 v240.92,27.43 | v244.22,12.57 244.22,11.3 243.71,10.79 IC17.57
/WAIT  (via drill 0.25)
  Top 0.203: v211.33,32.77 211.33,30.73 IC17.26
  Bottom 0.203: v211.33,32.77 211.33,33.91 R18.2
/WR  (via drill 0.25)
  Top 0.203: v59.31,39.24 59.94,38.61 59.94,36.45 | 59.94,36.45 59.94,11.3 59.31,10.67 IC4.27 | v15.37,44.07 v15.37,74.55 | v98.42,7.62 98.3,7.75 v98.3,24.77 97.79,25.27 v97.79,34.54 v97.79,45.34 | v93.22,64.64 93.09,64.52 v93.09,51.44 | v127,10.41 127.25,10.67 127.25,11.05 127.64,11.43 v127.64,22.86 | v117.47,25.4 v117.47,51.44 116.71,52.2 116.71,79.12 | v119.76,71.12 118.49,72.39 118.49,79.12 117.73,79.88 116.71,79.88 116.71,79.12 | v215.77,63.88 215.77,47.12 JP2.6 | v109.73,68.58 110.36,69.22 110.36,78.74 110.74,79.12 116.71,79.12 | v65.53,36.45 59.94,36.45
  Bottom 0.203: v59.31,39.24 56.39,39.24 55.5,40.13 53.47,40.13 53.21,40.39 IC2.18 50.93,40.89 50.16,41.66 43.94,41.66 41.4,44.2 15.49,44.2 v15.37,44.07 | v15.37,74.55 14.61,74.55 13.34,75.82 JP4.6 | v98.3,24.77 98.3,25.4 IC19.29 | v98.42,7.62 IC10.29 | v97.79,45.34 98.17,45.72 IC21.29 98.17,46.99 97.16,48.01 96.52,48.01 v93.09,51.44 | v93.22,64.64 96.77,64.64 98.17,66.04 IC23.29 98.68,67.31 99.95,68.58 v109.73,68.58 | v127,10.41 127,4.83 126.87,4.7 124.46,4.7 124.08,5.08 IC12.29 | v127.64,22.86 126.36,24.13 124.84,24.13 124.14,24.83 | 124.14,24.83 123.57,25.4 IC20.29 | v117.47,51.44 119.13,51.44 123.57,46.99 IC22.29 | v117.47,25.4 119.63,23.24 122.56,23.24 124.14,24.83 | 121.86,69.03 v119.76,71.12 | 121.86,69.03 123.57,67.31 IC24.29 | v215.77,63.88 211.96,67.69 211.96,70.61 158.37,70.61 157.99,70.99 149.61,70.99 147.7,69.09 121.92,69.09 121.86,69.03 | v65.53,36.45 65.66,36.58 83.31,36.58 84.84,35.05 86.74,35.05 87.25,34.54 v97.79,34.54
A0  (via drill 0.25)
  Top 0.203: v21.97,12.06 22.48,12.57 v22.48,24.77 21.34,25.91 21.34,56.39 22.35,57.4 25.78,57.4 25.78,60.96 23.75,62.99 IC1.8 | IC4.10 72.77,30.99 72.14,31.62 72.14,50.93 74.68,53.47 IC5.13 74.68,55.75 74.68,57.28 v71.5,60.45 | v108.58,41.4 v108.58,59.05 108.46,59.18 108.46,73.79 | v108.58,79.12 108.46,78.99 108.46,73.79 | v133.99,72.39 133.99,58.93 v133.86,58.8 v133.86,41.66 133.86,25.53 132.59,24.26 v132.59,22.23 | JP2.4 210.44,44.32 208.28,42.16 208.28,33.15 205.87,30.73 IC17.29 205.1,29.84 203.71,28.45 v200.03,28.45 | 139.64,17.21 139.06,17.78 v139.06,17.91 | 139.64,17.21 145.03,11.81 IC26.38 | v142.24,25.15 139.7,22.61 139.7,17.27 139.64,17.21 | v109.73,73.79 108.46,73.79
  Bottom 0.203: v21.97,12.06 IC8.14 | v22.48,24.77 IC9.14 | JP4.15 10.79,63.88 11.56,64.64 20.83,64.64 21.72,63.75 IC1.8 24,63.25 25.27,61.98 60.33,61.98 61.85,60.45 v71.5,60.45 | v108.58,41.4 IC19.12 | IC21.12 v108.58,59.05 106.81,57.28 77.22,57.28 75.44,55.5 IC5.13 | v108.58,79.12 IC23.12 | v133.86,41.66 133.86,40.64 IC20.12 | v133.86,58.8 133.86,59.69 IC22.12 | v133.99,72.39 IC24.12 133.73,81.28 133.35,81.66 132.08,81.66 132.08,74.68 131.32,73.91 109.86,73.91 v109.73,73.79 | IC10.12 108.84,20.32 108.84,22.1 122.56,22.1 122.68,22.23 v132.59,22.23 133.73,21.08 133.73,20.32 IC12.12 134.24,19.05 135.13,18.16 138.81,18.16 v139.06,17.91 | v200.03,28.45 199.52,27.94 191.9,27.94 191.52,27.56 162.31,27.56 162.18,27.69 149.1,27.69 146.56,25.15 v142.24,25.15
A1  (via drill 0.25)
  Top 0.203: v211.96,43.94 208.79,40.77 208.79,31.88 207.65,30.73 IC17.28 | v140.84,17.27 143.89,14.22 144.91,14.22 IC26.37 | v132.97,72.39 133.1,72.26 133.1,59.31 v133.22,59.18 v133.22,42.04 133.1,41.91 133.1,32.77 | v132.46,21.46 131.95,21.97 131.95,26.67 133.1,27.81 133.1,32.77 | v183.51,40.89 v175.64,33.02 | v133.22,32.77 133.1,32.77 | v17.53,12.95 v17.53,23.5 16,25.02 16,57.53 18.41,59.94 21.72,59.94 21.72,60.71 IC1.9 24,60.71 v25.15,59.56 | IC4.9 74.55,28.45 77.22,31.11 77.22,53.47 IC5.14 77.22,55.75 77.22,57.91 v76.07,59.05 | v107.95,79.63 107.95,61.98 v107.57,61.59 107.06,61.09 107.06,56.52 | v108.58,37.72 v108.58,23.75 | 107.06,56.52 107.06,45.59 105.66,44.2 105.66,41.78 v106.05,41.4 | v107.19,56.52 107.06,56.52
  Bottom 0.203: JP2.5 212.72,44.58 212.6,44.58 v211.96,43.94 211.84,43.81 191.39,43.81 188.47,40.89 v183.51,40.89 | v140.84,17.27 134.75,17.27 132.97,19.05 IC12.11 132.46,20.32 v132.46,21.46 | v133.22,42.04 132.97,42.04 132.97,40.64 IC20.11 | v133.22,59.18 132.72,59.69 IC22.11 132.97,60.96 133.35,61.34 138.3,61.34 138.43,61.21 138.43,56.52 v107.19,56.52 78.99,56.52 77.98,55.5 IC5.14 | v132.97,72.39 132.97,80.01 IC24.11 | v175.64,33.02 144.02,33.02 143.76,32.77 v133.22,32.77 | v17.53,12.95 19.43,11.05 IC8.13 | v17.53,23.5 IC9.13 | IC1.9 21.72,61.21 20.83,62.1 11.56,62.1 10.79,61.34 JP4.17 | v107.57,61.59 107.57,60.96 IC21.11 | v107.95,79.63 107.57,80.01 IC23.11 | v108.58,23.75 107.57,22.73 107.57,20.32 IC10.11 | v108.58,37.72 107.57,38.73 107.57,39.37 IC19.11 107.06,40.64 106.68,41.02 106.43,41.02 v106.05,41.4 | v25.15,59.56 25.27,59.44 59.94,59.44 60.33,59.05 v76.07,59.05
A2  (via drill 0.25)
  Top 0.203: v131.44,20.95 131.44,37.21 v131.57,37.34 132.08,37.85 132.08,58.67 v131.95,58.8 | v106.3,79.12 107.44,77.98 107.44,74.42 | 107.44,74.42 107.44,62.99 v107.31,62.87 106.55,62.1 106.55,45.72 105.16,44.32 105.16,39.62 105.92,38.86 105.92,36.96 v106.05,36.83 v106.05,23.37 | 107.44,74.42 v107.31,74.42 | v75.18,23.75 74.55,24.38 74.55,24.89 IC4.8 | v49.78,26.67 49.78,33.66 45.59,37.85 IC2.4 43.31,38.35 v41.91,39.75 | v31.11,58.42 35.94,53.59 v35.94,42.55
  Bottom 0.203: 141.48,16.51 140.08,16.51 139.83,16.76 133.99,16.76 131.7,19.05 IC12.10 v131.44,20.95 | 141.48,16.51 IC26.36 | v131.57,37.34 131.57,39.37 IC20.10 | 141.48,16.51 145.54,20.57 176.53,20.57 181.74,25.78 IC7.4 | IC21.10 106.17,60.96 106.17,62.87 v107.31,62.87 129.29,62.87 131.19,60.96 IC22.10 131.7,59.69 131.95,59.69 v131.95,58.8 | v106.3,79.12 106.3,80.01 IC23.10 | v107.31,74.42 131.19,74.42 131.19,80.01 IC24.10 | JP4.19 10.79,58.8 11.56,59.56 13.08,59.56 13.21,59.44 20.95,59.44 21.72,58.67 IC1.10 v31.11,58.42 | v75.18,23.75 75.69,23.24 95.5,23.24 95.63,23.37 v106.05,23.37 IC10.10 | v106.05,36.83 IC19.10 | v49.78,26.67 67.31,26.67 68.33,25.65 72.52,25.65 IC4.8 | v35.94,42.55 36.83,41.66 40.01,41.66 v41.91,39.75
A3  (via drill 0.25)
  Top 0.203: v105.28,38.61 105.41,38.48 v105.41,22.73 | v46.99,32 46.99,33.4 45.34,35.05 IC2.5 | v74.55,26.54 75.82,25.27 75.82,23.24 75.44,22.86 IC4.7 | v34.8,55.63 36.58,53.85 v36.58,36.96 | v143.13,15.88 145.16,17.91 145.16,18.54 IC26.35 | 104.78,75.06 v104.78,79.38 | 104.78,68.33 104.78,75.06 | 104.78,68.33 v104.78,63.5 | v129.54,41.02 v129.54,59.31 v129.54,75.06 | 104.78,75.06 v106.81,75.06 | v130.68,21.59 130.94,21.84 v130.94,38.86 | v102.11,41.27 102.11,61.09 102.23,61.21 102.23,65.02 102.11,65.15 102.11,65.66 104.78,68.33
  Bottom 0.203: JP4.21 10.79,56.26 11.56,57.02 13.08,57.02 13.46,56.64 21.21,56.64 21.72,56.13 IC1.11 24,56.13 24.64,56.77 29.97,56.77 31.11,55.63 v34.8,55.63 | 104.52,22.73 104.52,22.86 95.76,22.86 95.63,22.73 74.8,22.73 IC4.7 | 104.52,22.73 104.52,20.32 IC10.9 | v105.28,38.61 105.03,38.61 105.03,39.37 IC19.9 104.52,40.64 103.89,41.27 v102.11,41.27 | 104.52,22.73 v105.41,22.73 | v46.99,32 49.78,29.21 66.67,29.21 69.34,26.54 v74.55,26.54 | v36.58,36.96 36.96,36.58 42.55,36.58 43.31,35.81 IC2.5 | v143.13,15.88 135.51,15.88 135.13,16.26 130.43,16.26 130.43,19.05 IC12.9 130.43,20.32 130.43,21.59 v130.68,21.59 | IC7.5 181.74,23.24 178.56,20.07 147.96,20.07 147.19,19.3 IC26.35 | v104.78,63.5 IC21.9 | v104.78,79.38 IC23.9 | v129.54,41.02 129.92,40.64 IC20.9 130.43,39.37 v130.94,38.86 | v129.54,59.31 129.92,59.69 IC22.9 | IC24.9 129.92,80.01 129.92,75.06 v129.54,75.06 v106.81,75.06
A4  (via drill 0.25)
  Top 0.203: v126.87,77.34 126.87,62.74 v127.38,62.23 127.64,61.98 v127.64,41.66 | v129.41,21.59 129.54,21.72 v129.54,38.99 | v26.04,46.35 24.38,48.01 24.38,52.2 23.75,52.83 IC1.12 | v101.47,22.23 v101.47,36.83 101.47,41.53 101.6,41.66 v101.6,61.47 v101.6,75.69 101.6,77.47 v103.25,79.12 | v54.23,46.48 54.61,46.1 v54.61,33.78 | v69.6,27.18 72.14,24.64 72.14,21.46 72.77,20.83 IC4.6
  Bottom 0.203: v127.38,62.23 128.65,60.96 IC22.8 | IC24.8 128.91,79.38 v126.87,77.34 126.75,77.22 126.75,75.82 125.73,75.82 125.6,75.69 107.19,75.69 107.06,75.82 101.73,75.82 v101.6,75.69 | v129.41,21.59 129.16,21.59 129.16,20.32 IC12.8 129.16,19.05 129.16,16.89 130.3,15.75 131.19,15.75 131.7,15.24 176.28,15.24 181.74,20.7 IC7.6 | v129.54,38.99 129.16,39.37 IC20.8 128.65,40.64 v127.64,41.66 | v26.04,46.35 32.26,46.35 32.64,46.74 IC13.13 53.72,46.99 v54.23,46.48 | JP4.23 10.79,53.72 11.56,54.48 13.72,54.48 14.61,53.59 21.72,53.59 IC1.12 | 101.47,22.35 95.89,22.35 95.76,22.23 76.45,22.23 74.8,20.57 IC4.6 | 101.47,22.35 103.25,22.35 103.25,20.32 IC10.8 | v101.47,36.83 103.25,36.83 103.25,39.37 IC19.8 | 101.47,22.35 v101.47,22.23 | v101.6,61.47 102.74,61.47 103.25,60.96 IC21.8 | v103.25,79.12 103.25,80.01 IC23.8 | v54.61,33.78 56.13,32.26 57.15,32.26 57.91,31.5 65.02,31.5 69.34,27.18 v69.6,27.18
A5  (via drill 0.25)
  Top 0.203: v127,41.02 v127,59.31 | v102.11,20.95 v102.11,38.1 | v100.97,58.67 100.84,58.55 v100.84,41.27 | v175.51,11.43 181.99,17.91 IC7.7 | v124.08,37.34 123.83,37.08 v123.83,18.41 | v32,50.93 34.42,50.93 34.42,36.58 34.8,36.2 36.83,36.2 36.83,36.32 37.08,36.58 40.13,36.58 40.13,20.07 40.51,19.68 v41.53,19.68 | v128.27,79.63 130.18,77.72 v130.18,58.93
  Bottom 0.203: IC23.7 102.49,81.28 102.87,81.66 127,81.66 127.38,81.28 IC24.7 127.89,80.01 v128.27,79.63 | JP4.25 10.79,51.18 11.56,51.94 13.72,51.94 14.61,51.05 21.72,51.05 IC1.13 IC13.5 31.88,50.8 v32,50.93 | v127,41.02 127.38,40.64 IC20.7 127.38,39.37 127.38,37.34 v124.08,37.34 | v127,59.31 127.38,59.69 IC22.7 127.89,59.69 128.91,58.67 129.92,58.67 v130.18,58.93 | 126.81,18.48 127.38,19.05 IC12.7 | 126.81,18.48 126.75,18.41 v123.83,18.41 103.12,18.41 102.49,19.05 IC10.7 | v102.11,38.1 102.11,39.37 IC19.7 101.98,40.64 101.85,40.64 101.47,41.02 101.09,41.02 v100.84,41.27 | v102.11,20.95 102.11,20.32 IC10.7 | v100.97,58.67 101.98,59.69 IC21.7 | IC10.7 101.98,19.05 100.71,17.78 IC4.5 72.52,18.03 71.75,18.8 57.91,18.8 56.9,19.81 41.66,19.81 v41.53,19.68 | v175.51,11.43 174.37,10.29 132.21,10.29 130.18,12.32 126.24,12.32 125.86,12.7 125.86,13.72 130.94,13.72 131.32,14.1 131.32,14.99 130.3,14.99 126.81,18.48
A6  (via drill 0.25)
  Top 0.203: v126.49,12.95 126.49,21.46 v126.36,21.59 v126.36,38.61 v126.36,58.42 126.24,58.55 v126.24,79.12 123.06,82.3 100.97,82.3 v100.97,81.92 | v77.72,18.41 74.8,15.49 IC4.4 | v100.84,20.95 v100.84,37.21 100.84,38.73 100.2,39.37 100.2,41.53 100.33,41.66 v100.33,59.31 100.84,59.82 100.84,78.36 v100.97,78.49 | v40.26,50.55 41.27,51.56 v41.27,58.29
  Bottom 0.203: v126.36,21.59 IC12.6 | v126.36,38.61 IC20.6 | v126.36,58.42 IC22.6 | v126.24,79.12 126.24,80.01 IC24.6 | v126.49,12.95 161.8,12.95 162.69,12.06 178.18,12.06 181.74,15.62 IC7.8 | JP4.27 10.79,48.64 11.56,49.4 13.72,49.4 14.61,48.51 21.72,48.51 IC1.14 24,48.51 25.65,48.51 26.42,49.28 IC13.4 28.32,49.28 28.57,49.02 30.1,49.02 30.23,48.9 36.7,48.9 37.59,49.78 39.5,49.78 v40.26,50.55 | v77.72,18.41 100.08,18.41 100.71,19.05 IC10.6 100.84,20.32 v100.84,20.95 | v100.84,37.21 100.84,39.37 IC19.6 | v100.33,59.31 100.71,59.69 IC21.6 100.84,60.96 100.84,61.85 100.46,62.23 98.17,62.23 97.28,61.34 96.52,61.34 96.52,58.93 96.01,58.42 41.4,58.42 v41.27,58.29 | v100.97,78.49 IC23.6 v100.97,81.92
A7  (via drill 0.25)
  Top 0.203: v100.2,38.48 v100.2,21.72 100.2,20.7 100.33,20.57 100.33,6.99 98.17,6.99 97.79,7.37 97.79,11.18 v96.9,12.06 | v26.16,31.24 26.16,42.8 23.75,45.21 IC1.15 | v48.26,28.96 49.15,28.07 v49.15,14.35 | v100.2,61.59 100.33,61.72 100.33,76.33 | 100.33,76.33 v100.33,79.63 | v125.35,76.33 125.6,76.07 v125.6,58.42 125.73,58.29 v125.73,38.99 v125.73,20.7 125.73,10.54 131.7,4.57 131.7,2.29 177.42,2.29 184.4,9.27 184.4,12.19 183.77,12.83 IC7.9 | 100.33,76.33 v100.2,76.33 | v98.42,41.53 v98.42,58.42
  Bottom 0.203: IC13.2 25.02,46.99 24,45.97 IC1.15 21.72,45.97 14.61,45.97 13.72,46.86 11.56,46.86 10.79,46.1 JP4.29 | v100.2,21.72 99.95,21.72 99.95,20.32 IC10.5 | v100.2,38.48 100.2,39.37 99.95,39.37 IC19.5 99.44,40.64 98.55,41.53 v98.42,41.53 | v96.9,12.06 75.18,12.06 74.8,12.45 IC4.3 72.52,12.95 71.5,13.97 49.53,13.97 v49.15,14.35 | v26.16,31.24 27.43,29.97 42.93,29.97 43.94,28.96 v48.26,28.96 | v100.2,61.59 99.95,61.59 99.95,60.96 IC21.5 99.44,59.69 99.44,58.8 99.06,58.42 v98.42,58.42 | v100.33,79.63 99.95,80.01 IC23.5 | v125.73,20.7 125.35,20.32 IC12.5 | v125.73,38.99 125.35,39.37 IC20.5 | v125.6,58.42 125.35,58.42 125.35,59.69 IC22.5 | IC24.5 125.35,80.01 v125.35,76.33 v100.2,76.33
A8  (via drill 0.25)
  Top 0.203: v25.15,25.4 24.89,25.65 24.89,41.53 23.75,42.67 IC1.16 | v49.78,23.5 v49.78,16.38 | v104.01,7.62 v104.01,10.79 v104.01,24 104.14,24.13 104.14,27.81 104.39,28.07 104.39,29.72 104.14,29.97 104.14,44.32 v104.01,44.45 | v99.19,64.77 99.06,64.64 99.06,60.2 97.79,58.93 v97.79,51.82 v97.79,49.91 | v127,25.02 127,14.48 127.13,14.35 127.13,11.56 v126.36,10.79 | v124.46,67.69 124.08,67.31 124.08,59.31 123.7,58.93 v123.7,49.4 | v55.24,14.61 56.01,13.84 56.01,6.1 57.4,4.7 70.87,4.7 v70.87,6.86
  Bottom 0.203: v25.15,25.4 IC3.13 34.04,25.15 34.42,24.77 40.51,24.77 40.89,24.38 48.9,24.38 v49.78,23.5 | v49.78,16.38 55.24,16.38 | 55.24,16.38 56.39,16.38 57.28,15.49 IC4.25 | JP4.31 10.79,43.56 11.56,44.32 13.72,44.32 14.61,43.43 21.72,43.43 IC1.16 | v104.01,7.62 102.49,7.62 101.22,6.35 IC10.27 | v104.01,24 103.89,24.13 102.49,24.13 101.22,25.4 IC19.27 | v104.01,44.45 103.89,44.32 101.22,44.32 101.22,45.72 IC21.27 100.71,46.99 v97.79,49.91 | v99.19,64.77 100.71,64.77 100.71,66.04 IC23.27 | 126.11,10.79 126.11,6.35 IC12.27 | 126.11,10.79 v104.01,10.79 92.46,10.79 90.81,9.14 73.15,9.14 v70.87,6.86 | v127,25.02 126.62,25.4 IC20.27 | 126.11,10.79 v126.36,10.79 | v97.79,51.82 113.03,51.82 113.03,45.47 114.05,44.45 126.11,44.45 126.11,45.72 IC22.27 126.11,46.99 v123.7,49.4 | v124.46,67.69 125.73,67.69 126.11,67.31 IC24.27 | 55.24,16.38 v55.24,14.61
A9  (via drill 0.25)
  Top 0.203: v25.15,21.59 24.38,22.35 24.38,39.5 23.75,40.13 IC1.17 | v55.5,20.95 55.5,20.32 57.53,18.29 IC4.24 | v102.74,6.99 102.87,7.11 102.87,16.51 | 102.87,16.51 102.87,24.77 v102.74,24.89 102.87,25.02 102.87,34.67 | 102.87,34.67 102.87,37.85 102.74,37.97 v102.74,44.96 v102.74,65.41 | v127.89,10.79 128.27,11.18 128.27,24.77 v128.14,24.89 128.27,25.02 v128.27,34.67 v128.27,45.34 128.14,45.47 128.14,64.9 v127.89,65.15 | 102.87,34.67 v102.74,34.67 | v71.12,17.4 v72.39,16.13 | v102.74,16.51 102.87,16.51
  Bottom 0.203: v25.15,21.59 28.57,21.59 30.1,23.11 31.37,23.11 32.13,23.88 IC3.12 36.83,24.13 36.83,23.37 37.97,22.23 41.66,22.23 42.55,21.34 55.12,21.34 v55.5,20.95 | JP4.33 10.79,41.02 11.56,41.78 13.72,41.78 14.61,40.89 21.72,40.89 IC1.17 | v102.74,6.99 102.49,6.99 102.49,6.35 IC10.26 | v102.74,24.89 102.23,25.4 IC19.26 | v102.74,44.96 102.49,44.96 102.49,45.72 IC21.26 | v102.74,65.41 102.49,65.41 102.49,66.04 IC23.26 | v127.89,10.79 127.89,6.35 IC12.26 | v128.14,24.89 127.64,25.4 IC20.26 | v128.27,45.34 127.89,45.72 IC22.26 | v127.89,65.15 127.89,66.04 IC24.26 | v102.74,34.67 v128.27,34.67 | v71.12,17.4 59.69,17.4 59.56,17.53 IC4.24 | v72.39,16.13 72.52,16.26 82.8,16.26 83.06,16.51 v102.74,16.51
A10  (via drill 0.25)
  Top 0.203: v34.54,22.23 32.89,23.88 v32.89,38.73 | v55.75,24.77 54.86,23.88 v54.86,19.18 | v131.44,51.44 131.32,51.56 131.32,59.44 | 131.32,59.44 131.32,65.15 v131.44,65.28 | v131.7,7.49 133.22,9.02 133.22,14.35 | 133.22,14.35 v133.22,23.88 | 131.32,59.44 132.59,59.44 132.59,28.19 v132.08,27.69 | v106.3,7.62 107.31,8.64 v107.31,14.73 v107.31,23.37 107.31,25.15 106.68,25.78 106.68,43.56 v106.3,43.94 | v104.14,49.28 v104.14,64.77 | v130.68,14.35 133.22,14.35 | v60.58,26.04 66.17,31.62 v66.17,43.69
  Bottom 0.203: v34.54,22.23 34.42,22.23 34.04,21.84 IC3.10 32.13,21.84 31.37,22.61 30.48,22.61 30.23,22.35 30.1,22.35 30.1,20.19 31.88,18.41 54.1,18.41 v54.86,19.18 | v32.89,38.73 32.77,38.61 23.75,38.61 IC1.18 21.72,38.35 14.61,38.35 13.72,39.24 11.56,39.24 10.79,38.48 JP4.35 | v55.75,24.77 56.9,24.77 57.28,25.15 IC4.21 59.56,25.65 59.94,26.04 v60.58,26.04 | v131.44,51.44 IC22.23 | v131.44,65.28 IC24.23 | v131.7,7.49 131.7,6.35 IC12.23 | v133.22,23.88 131.7,25.4 IC20.23 131.7,26.67 132.08,26.67 v132.08,27.69 | v106.3,7.62 106.3,6.35 IC10.23 | v107.31,23.37 106.05,24.64 IC19.23 | v104.14,64.77 106.05,64.77 IC23.23 | v104.14,49.28 105.79,47.62 105.79,46.99 IC21.23 106.3,45.72 v106.3,43.94 106.17,43.81 101.09,43.81 100.71,44.2 66.67,44.2 v66.17,43.69 | v130.68,14.35 130.56,14.48 127,14.48 126.75,14.73 v107.31,14.73
A11  (via drill 0.25)
  Top 0.203: v29.34,35.56 29.46,35.43 29.46,26.8 28.96,26.29 28.96,23.75 v30.73,21.97 | v128.78,10.79 128.78,24.64 v128.91,24.77 v128.91,34.04 v128.91,43.94 v128.91,65.15 | v103.5,6.99 103.38,7.11 103.38,24.64 v103.5,24.77 | v103.5,50.55 v103.5,65.41 | v104.78,27.56 104.9,27.69 104.9,34.04 | 104.9,34.04 104.9,38.1 104.65,38.35 v104.65,44.83 | 104.9,34.04 v104.78,34.04 | v64.52,23.5 v69.22,28.19
  Bottom 0.203: JP4.37 10.79,35.94 11.56,36.7 13.08,36.7 13.21,36.58 20.95,36.58 21.72,35.81 IC1.19 v29.34,35.56 | v30.73,21.97 32.13,20.57 IC3.9 34.04,20.57 34.42,20.95 42.29,20.95 42.93,20.32 IC4.23 59.56,20.57 62.48,23.5 v64.52,23.5 | v128.78,10.79 128.78,6.35 IC12.25 | v128.91,24.77 IC20.25 | v128.91,43.94 IC22.25 | v128.91,65.15 IC24.25 | v103.5,6.99 IC10.25 | IC19.25 v103.5,24.77 | v103.5,50.55 IC21.25 103.76,45.72 v104.65,44.83 | v103.5,65.41 IC23.25 | v104.78,27.56 104.65,27.56 103.76,26.67 IC19.25 | v104.78,34.04 v128.91,34.04 | v69.22,28.19 70.48,29.46 90.81,29.46 92.46,31.11 98.81,31.11 103.25,26.67 IC19.25
A12  (via drill 0.25)
  Top 0.203: v124.46,20.7 124.46,36.83 124.71,37.08 124.71,37.85 124.46,38.1 v124.46,38.99 124.33,39.12 124.33,48.77 | 124.33,48.77 v124.33,58.67 | v98.93,21.72 v98.93,38.86 99.06,38.99 99.06,58.8 v98.81,59.05 | v98.42,61.59 v98.42,77.22 v98.42,78.49 | 124.33,48.77 123.06,48.77 123.06,58.29 123.19,58.42 123.19,61.59 123.57,61.98 v123.57,77.22 | v33.53,33.15 33.53,25.02 v35.05,23.5 35.18,23.37 35.18,11.56 v37.85,8.89 | v90.93,36.83 89.79,35.69 89.79,35.05 88.77,34.04 87,34.04 87,33.78 86.11,32.89 86.11,12.32 v84.2,10.41
  Bottom 0.203: v124.46,20.7 124.08,20.32 IC12.4 | v124.46,38.99 124.08,39.37 IC20.4 | v124.33,58.67 124.08,58.67 124.08,59.69 IC22.4 | v98.93,21.72 98.68,21.72 98.68,20.32 IC10.4 | 98.61,39.18 98.42,39.37 IC19.4 | 98.61,39.18 v98.93,38.86 | v98.81,59.05 98.68,59.05 98.68,59.69 IC21.4 v98.42,61.59 | v98.42,78.49 IC23.4 | v98.42,77.22 v123.57,77.22 123.7,77.22 123.7,80.01 IC24.4 | v35.05,23.5 36.83,21.72 38.35,21.72 IC3.5 | v33.53,33.15 24,33.15 IC1.20 21.72,33.27 14.61,33.27 13.72,34.16 11.56,34.16 10.79,33.4 JP4.39 | v37.85,8.89 71.5,8.89 72.52,9.91 IC4.2 74.8,10.41 v84.2,10.41 | v90.93,36.83 96.27,36.83 98.61,39.18
A13  (via drill 0.25)
  Top 0.203: v37.85,23.5 38.1,23.75 IC1.21 | v54.23,21.97 54.23,16.51 57.53,13.21 IC4.26 | 99.57,13.21 v99.57,24.77 99.57,44.7 v99.69,44.83 99.57,44.96 99.57,61.85 99.82,62.1 99.82,65.28 v99.69,65.41 | 99.57,13.21 v99.57,7.62 | v125.09,10.16 v125.09,13.08 v125.09,24.77 125.22,24.89 125.22,37.97 125.09,38.1 v125.09,45.09 124.97,45.21 v124.97,65.15 | v99.69,13.21 99.57,13.21 | v70.74,12.95 72.14,12.95 72.14,13.21 72.77,13.84 v80.52,13.84
  Bottom 0.203: v37.85,23.5 37.97,23.5 38.35,23.11 IC3.4 40.26,22.73 41.78,22.73 42.67,21.84 54.1,21.84 v54.23,21.97 | JP4.41 10.79,30.86 11.81,31.88 27.94,31.88 28.57,32.51 37.21,32.51 IC1.21 | v99.57,7.62 99.57,6.35 IC10.28 | v99.57,24.77 99.57,25.4 IC19.28 | v99.69,44.83 IC21.28 | v99.69,65.41 IC23.28 | v125.09,10.16 IC12.28 | v125.09,24.77 IC20.28 | v125.09,45.09 IC22.28 | v124.97,65.15 124.97,66.04 IC24.28 | v125.09,13.08 99.82,13.08 v99.69,13.21 99.57,13.34 81.03,13.34 v80.52,13.84 | v70.74,12.95 59.56,12.95 IC4.26
A14  (via drill 0.25)
  Top 0.203: v24.26,21.59 24.26,10.29 v25.02,9.53 25.15,9.4 25.15,5.97 v27.43,3.68 | v37.47,26.04 37.59,26.16 37.59,29.59 36.58,30.61 36.58,34.42 37.21,35.05 IC1.22
  Bottom 0.203: v24.26,21.59 24.89,22.23 IC9.5 28.57,22.23 28.57,23.37 27.81,24.13 25.27,24.13 25.15,24.26 24.51,24.26 24.51,25.4 | v25.02,9.53 IC8.5 | 24.51,25.4 24.51,25.91 25.27,26.67 29.84,26.67 30.48,26.04 v37.47,26.04 37.97,26.04 38.35,25.65 IC3.2 | v27.43,3.68 77.6,3.68 77.6,6.48 77.22,6.86 75.31,6.86 74.8,7.37 IC4.1 | 24.51,25.4 16.13,25.4 14.99,26.54 11.81,26.54 10.79,27.56 JP4.43
A15  (via drill 0.25)
  Top 0.203: v27.94,11.43 v27.94,22.86 28.07,22.99 28.07,26.54 28.26,26.73 | 28.26,26.73 v28.83,27.3 | v28.07,34.92 28.19,34.8 28.19,26.8 28.26,26.73
  Bottom 0.203: v27.94,11.43 27.56,11.05 IC8.4 | v27.94,22.86 27.56,23.24 IC9.4 25.65,23.62 24.51,23.62 24,24.13 11.68,24.13 10.79,25.02 JP4.45 | v28.83,27.3 37.97,27.3 38.35,26.92 IC3.1 | v28.07,34.92 29.59,34.92 32.26,37.59 36.7,37.59 36.96,37.85 IC1.23
AD0  (via drill 0.25)
  Top 0.203: v228.85,13.34 228.85,11.05 IC17.49
  Bottom 0.203: 227.52,14.54 227.71,14.73 IC16.9 | 227.52,14.54 226.57,13.59 207.14,13.59 206.63,14.1 IC15.12 | v228.85,13.34 227.71,14.48 227.58,14.48 227.52,14.54
AD1  (via drill 0.25)
  Top 0.203: v208.28,15.62 v211.07,12.83 | v229.49,12.95 229.49,11.94 230.38,11.05 IC17.50